# Altium schematic sheet Power Supply.SchDoc
size A4
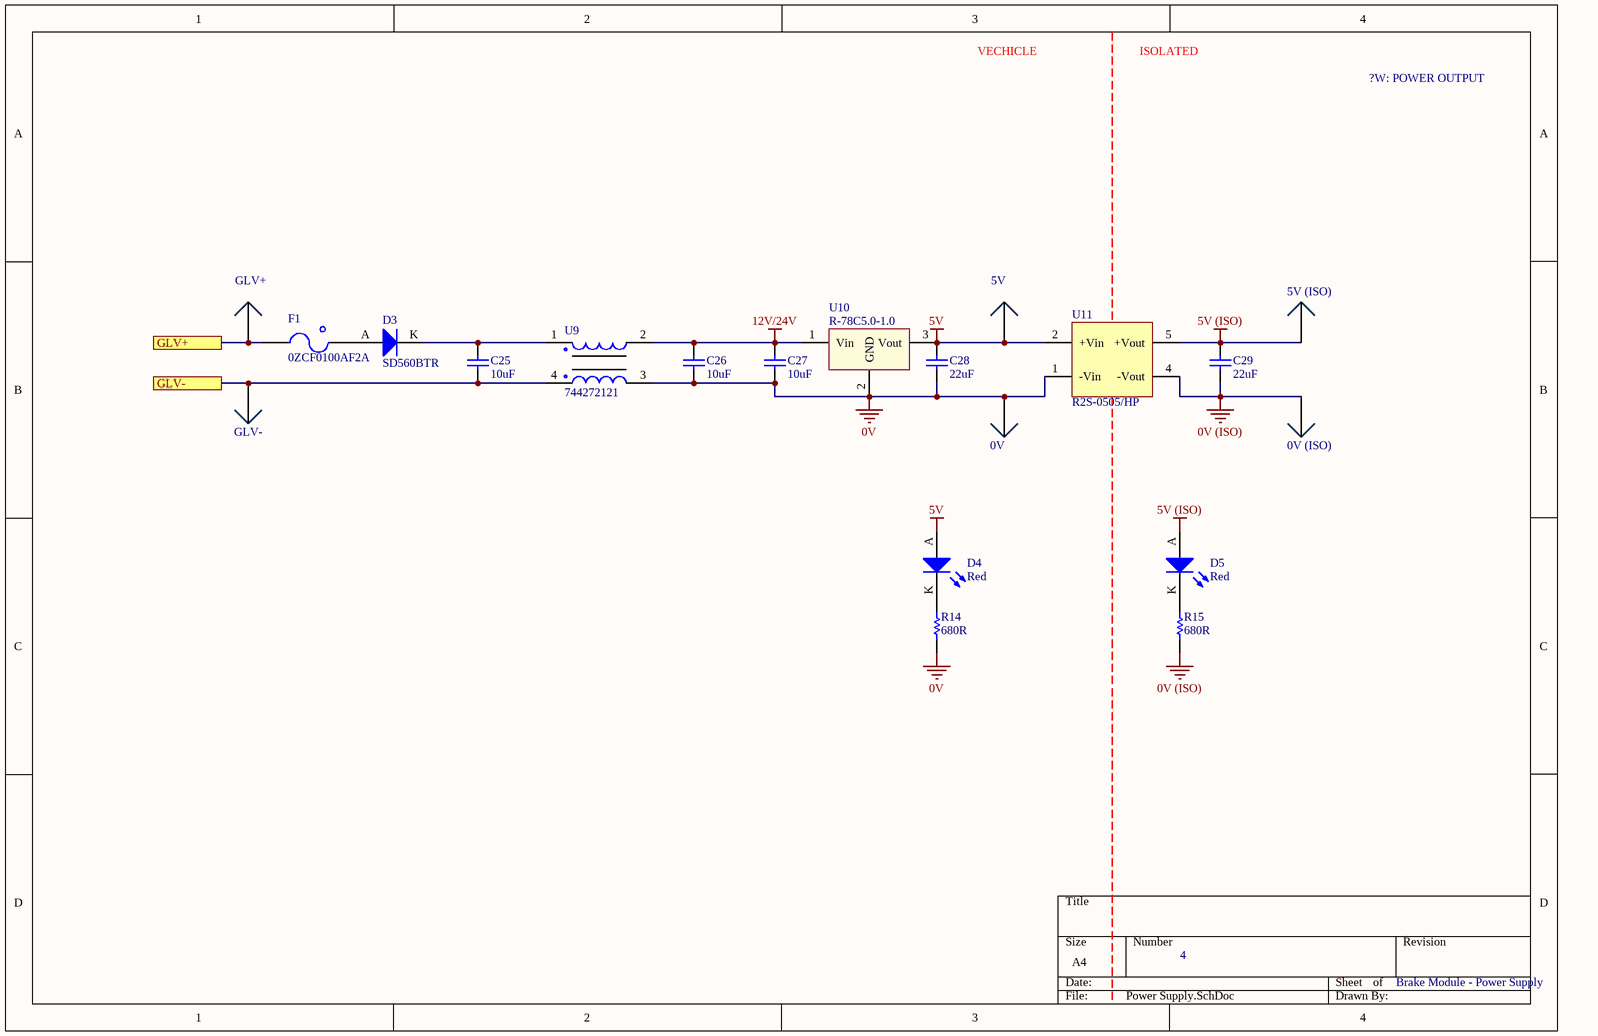
[diagram p0: Power Supply.SchDoc]

## Parts
0V  0mm  [SMD Test Point]  (value not drawn)
0V_(ISO)  0mm  [SMD Test Point]  (value not drawn)
5V  0mm  [SMD Test Point]  (value not drawn)
5V_(ISO)  0mm  [SMD Test Point]  (value not drawn)
C25  10uF  [0805]
C26  10uF  [0805]
C27  10uF  [0805]
C28  22uF  [1206]
C29  22uF  [1206]
D3  SD560BTR  [SMB Diode]
D4  Red  [0805 LED]
D5  Red  [0805 LED]
F1  0ZCF0100AF2A  [2920]
GLV+  0mm  [SMD Test Point]  (value not drawn)
GLV-  0mm  [SMD Test Point]  (value not drawn)
R14  680R  [0805]
R15  680R  [0805]
U9  744272121  [Wurth 4-PC Pad]
U10  R-78C5.0-1.0  [RECOM 3-SIP]
U11  R2S-0505/HP  [RECOM 8-SMD (5 Pin)]

## Ports
GLV+, GLV-

## Nets
0V: 0V.1 C26.1 C27.1 C28.1 R14.1 U9.3 U10.2(GND) U11.1(-Vin)
0V (ISO): 0V_(ISO).1 C29.1 R15.1 U11.4(-Vout)
5V: 5V.1 C28.2 D4.A U10.3(Vout) U11.2(+Vin)
5V (ISO): 5V_(ISO).1 C29.2 D5.A U11.5(+Vout)
12V/24V: C26.2 C27.2 U9.2 U10.1(Vin)
GLV+: F1.1 GLV+.1 ; port GLV+
GLV-: C25.1 GLV-.1 U9.4 ; port GLV-
NetC25_2: C25.2 D3.K U9.1
NetD3_A: D3.A F1.2
NetD4_K: D4.K R14.2
NetD5_K: D5.K R15.2

## Notes on the sheet
- VECHICLE
- ISOLATED
- ?W: POWER OUTPUT
- 4
- Brake Module - Power Supply

## Library data of the parts
0V 0V_(ISO) 5V 5V_(ISO) GLV+ GLV- = SMD Test Point: Positions: 1; Row Spacing: 0; Flange: No; Contact: NA; Part Number: SMD Test Point; Pitch: 0mm; Angle: 0
C25-C27 = GRM21BR6YA106KE43L: Manufacturer: muRata; Tolerance: 10%; Material: X5R; Rated Voltage: 50V; Part Number: GRM21BR6YA106KE43L; Value: 10uF; Digikey Part Number: 490-10514-6-ND
C28 C29 = CC1206MKX5R7BB226: Manufacturer: YAGEO; Tolerance: 20%; Material: Ceramic; Rated Voltage: 16V; Part Number: CC1206MKX5R7BB226; Value: 22uF; Digikey Part Number: 311-1997-2-ND
D3 = SD560BTR: 1.2V_F 600V 5A SMB; Manufacturer: SMC Diode Solutions; Part Number: SD560BTR; Digikey Part Number: 1655-1530-2-ND; Digikey Link: https://www.digikey.com/product-detail/en/smc-diode-solutions/SD560BTR/1655-1530-2-ND/6022620
D4 D5 = SML-210LTT86: Red LED Indication - Discrete 1.75V 0805 (2012 Metric); Manufacturer: ROHM Semiconductor; Part Number: SML-210LTT86; Colour: Red; Digikey Part Number: 511-1286-1-ND; Digikey Link: https://www.digikey.com/product-detail/en/rohm-semiconductor/SML-210LTT86/511-1286-1-ND/637099
F1 = 0ZCF0100AF2A: PTC RESET FUSE 60V 1A 292; Manufacturer: Littelfuse Inc.; Part Number: 0ZCF0100AF2A; Digikey Part Number: 507-2070-1-ND; Digikey Link: https://www.digikey.com/product-detail/en/bel-fuse-inc/0ZCF0100AF2A/507-2070-1-ND/6210547
R14 R15 = RC0805FR07680RL: Manufacturer: YAGEO; Tolerance: 0.01; Rated Voltage: 0.125W; Part Number: RC0805FR07680RL; Value: 680R; Material: FR-07; Digikey Part Number: 311-680CRCT-ND
U9 = 744272121: 120µH @ 100kHz 2 Line Common Mode Choke Surface Mount 460 Ohms @ 30MHz 2.5A DCR 25mOhm; Manufacturer: Wurth Electronics Inc; Inductance: 120uH @ 100kHz; Part Number: 744272121; Impedence: 460 Ohms @ 30MHz; Material: Wirewound; Rated Current: 2.5A; Digikey Part Number: 732-1489-1-ND; Digikey Link: https://www.digikey.com/product-detail/en/w-rth-elektronik/744272121/732-1489-1-ND/1639501
U10 = R-78C5.0-1.0: CONV DC/DC 1A 5V OUT SIP VERT; Manufacturer: Recom; Isolation: Non-Isolated; Part Number: R-78C5.0-1.0; Digikey Part Number: 945-1395-5-ND; Digikey Link: https://www.digikey.com.au/product-detail/en/recom-power/R-78C5.0-1.0/945-1395-5-ND/2652148
U11 = R2S-0505/HP: Isolated Module DC DC Converter 1 Output 3.3V 606mA 4.5V - 5.5V Input; Manufacturer: Recom; Output Voltage: 5V; Output Power: 2W; Efficiency: 0.85; Part Number: R2S-0505/HP; Input Voltage: 4.5V-5.5V; Isolation: Isolated; Digikey Part Number: 945-1764-5-ND; Digikey Link: https://www.digikey.com/product-detail/en/recom-power/R2S-0505-HP/945-1764-5-ND/2302761